# Altium project C2Sv1 OV7670 Breakout.PrjPcb
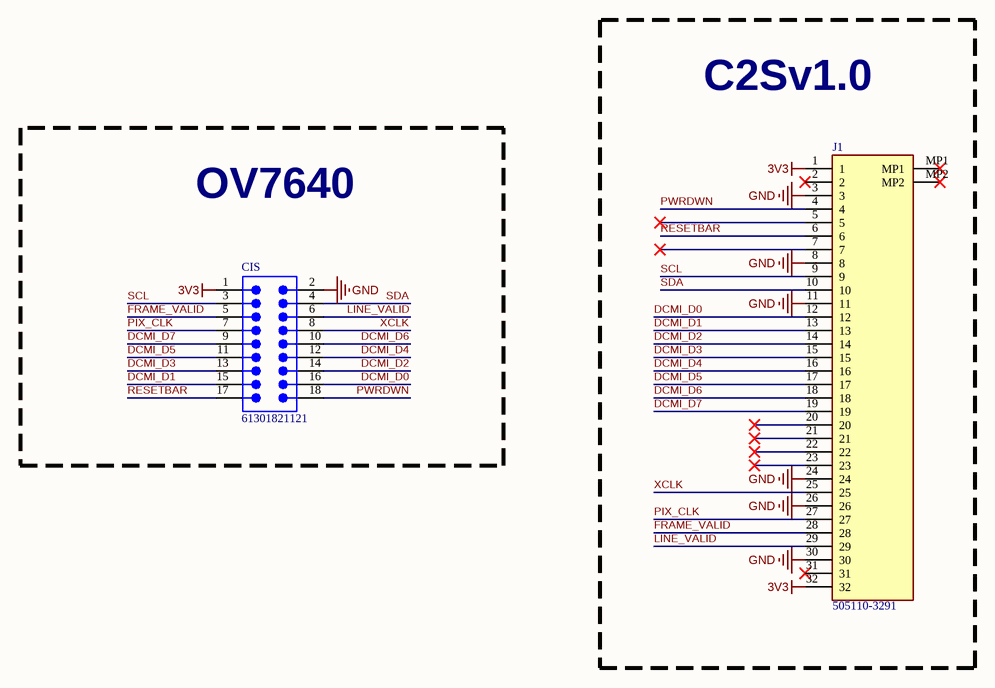
[diagram p0: C2Sv1 OV7670 Breakout_TopLevel.SchDoc]
1 sheet, 2 parts. Net scope: global (net labels, ports and power ports of the same name join across sheets).
Board file: C2Sv1 OV7670 Breakout.PcbDoc

## Sheet C2Sv1 OV7670 Breakout_TopLevel.SchDoc
size A3; SheetNumber: 1; SheetTotal: 1

### Parts
CIS  61301821121  [61301821121]
J1  505110-3291  [5051103291]

### Blocks framed on the sheet
C2Sv1.0: J1
OV7640: CIS

### Nets
3V3: CIS.1 J1.1 J1.32
GND: CIS.2 J1.3 J1.8 J1.11 J1.24 J1.26 J1.30
DCMI_D0: CIS.16 J1.12
DCMI_D1: CIS.15 J1.13
DCMI_D2: CIS.14 J1.14
DCMI_D3: CIS.13 J1.15
DCMI_D4: CIS.12 J1.16
DCMI_D5: CIS.11 J1.17
DCMI_D6: CIS.10 J1.18
DCMI_D7: CIS.9 J1.19
FRAME_VALID: CIS.5 J1.28
LINE_VALID: CIS.6 J1.29
PIX_CLK: CIS.7 J1.27
PWRDWN: CIS.18 J1.4
RESETBAR: CIS.17 J1.6
SCL: CIS.3 J1.9
SDA: CIS.4 J1.10
XCLK: CIS.8 J1.25

Not connected (* = marked no-connect by the designer): J1 2* 5* 7* 20* 21* 22* 23* 31* MP1* MP2*

### Notes on the sheet
- Title:
- Version:
- Revision:
- Perth Aerospace Student Team
- Size:
- Date:
- A3
- Project:
- Sheet
- of
- Author:
- Approved By:
- Curtin University
- Kent Street, Bentley
- Western Australia, 6152
- File:

### Library data of the parts
CIS = CMP-096-000238-1: WR-PHD Pin Header, THT, Vertical, pitch 2.54mm, 2 Row, 18P; Manufacturer: Wurth Elektronik; Withstanding Voltage: 500V; Working Voltage: 250V; Rated Current: 3A; Contact Resistance: 20mOhm; ComponentLink1URL: https://www.we-online.com/redexpert/article/61301821121?ad; Match Code: WR-PHD; Number of Rows: 2; ComponentLink2URL: https://www.we-online.com/redexpert/spec/61301821121?ad; Operating Temperature Min: -40°C; Orientation: Vertical; Component Type: Standard; ComponentLink1Description: Website Link; Pitch: 2.54mm; ComponentLink2Description: Datasheet Link; Manufacturer Part Number: 61301821121; Packaging: Bag; Operating Temperature Max: 105°C; Mount: Through Hole; Design Item ID: 61301821121; Pin Count: 18; Gender: Pin Header; Source: WR-PHD.SchLib; Number of Pins: 18; Category: Board-to-Board Connectors
J1 = CMP-220-000001-1: Easy-On FFC/FPC Connector; Manufacturer_Name: Molex; Added By: Felix Abbott; Mouser Part Number: 538-505110-3291; Height: 4.06mm; Source: Schlib1.SchLib; Manufacturer_Part_Number: 505110-3291; Mouser Price/Stock: https://www.mouser.co.uk/ProductDetail/Molex/505110-3291?qs=0lSvoLzn4L9xGyl4KYdheA%3D%3D; Design Item ID: 505110-3291; Datasheet Link: https://www.molex.com/pdm_docs/sd/5051103291_sd.pdf